# Altium schematic sheet VREF_ADR130A.SchDoc
size A3; DocumentNumber: 1; SheetNumber: 1; SheetTotal: 5
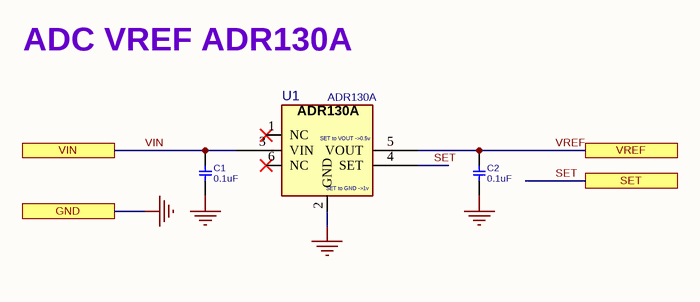
[diagram p0: VREF_ADR130A.SchDoc]

## Parts
C1  0.1uF  [C0402]
C2  0.1uF  [C0402]
U1  ADR130A  [SOT23_6]

## Ports
GND, SET, VIN, VREF

## Nets
GND: C1.2 C2.2 U1.2(GND) ; port GND
SET: U1.4(SET) ; port SET
VIN: C1.1 U1.3(VIN) ; port VIN
VREF: C2.1 U1.5(VOUT) ; port VREF

Not connected (* = marked no-connect by the designer): U1 1(NC)* 6(NC)*

## Notes on the sheet
- ADC VREF ADR130A
- (in symbol ADR130A_SOT23) SET to VOUT ->0.5v; SET to GND ->1v

## Library data of the parts
C1 C2 = CAP_SMD_MLCC_100n50T: CAP, MLCC; PARAM: 50V; PARAM2: X5R, 10%; MANF_P#: -; MANF: -; DESC: -; ASSEMBLY: ASSEMBLY; PRICE: 100= 5$; VALUE: 0.1uF
U1 = ADR130A_SOT23: VREF, Sub-Band Gap; MANF: Analog Devices; MANF_P#: ADR130AUJZ; PARAM2: 0.5/1v, 2~18VIN; PARAM: ±0.70%, 50 ppm/°C, -40~125°C; PACKAGE: SOT23-6; VALUE: ADR130A